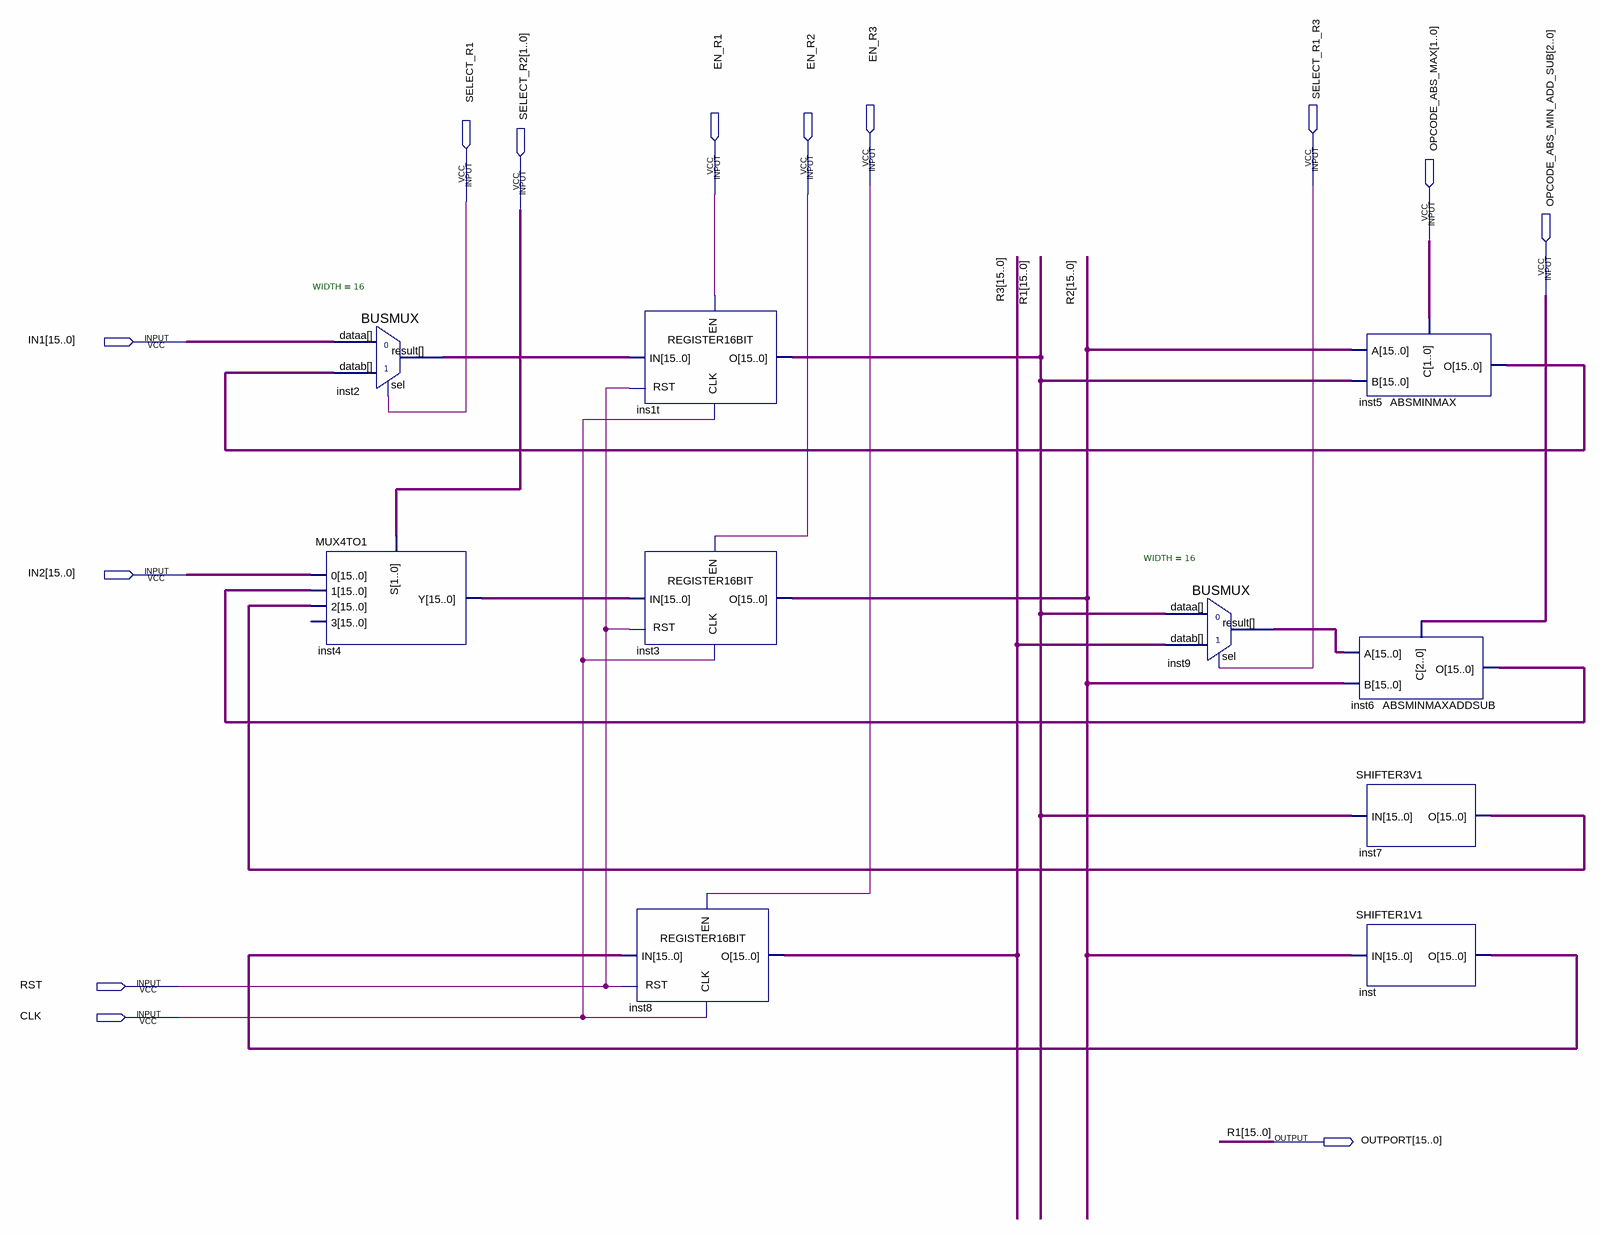
[diagram p0: schematic sheet]
// Quartus schematic DATAPATH_SF.bdf as structural Verilog: 10 symbols, 13 pins
module DATAPATH_SF (
  input  EN_R3,
  input  SELECT_R1_R3,
  input  EN_R1,
  input  EN_R2,
  input  SELECT_R1,
  input  [1:0] SELECT_R2,
  input  [1:0] OPCODE_ABS_MAX,
  input  [2:0] OPCODE_ABS_MIN_ADD_SUB,
  input  [15:0] IN1,
  input  [15:0] IN2,
  input  RST,
  input  CLK,
  output [15:0] OUTPORT
);

  wire [15:0] inst2_result, inst4_y, inst5_o, inst6_o, inst7_o, inst9_result, inst_o, R2, R3;

  BUSMUX #(.WIDTH(16)) inst2 (.datab(inst5_o), .sel(SELECT_R1), .dataa(IN1), .result(inst2_result));
  MUX4TO1 inst4 (.\0 (IN2), .\1 (inst6_o), .\2 (inst7_o), .S(SELECT_R2), .Y(inst4_y));  // open: 3
  REGISTER16BIT ins1t (.IN(inst2_result), .EN(EN_R1), .CLK(CLK), .RST(RST), .O(OUTPORT));
  REGISTER16BIT inst3 (.IN(inst4_y), .EN(EN_R2), .CLK(CLK), .RST(RST), .O(R2));
  REGISTER16BIT inst8 (.IN(inst_o), .EN(EN_R3), .CLK(CLK), .RST(RST), .O(R3));
  BUSMUX #(.WIDTH(16)) inst9 (.datab(R3), .sel(SELECT_R1_R3), .dataa(OUTPORT), .result(inst9_result));
  ABSMINMAX inst5 (.C(OPCODE_ABS_MAX), .A(R2), .B(OUTPORT), .O(inst5_o));
  ABSMINMAXADDSUB inst6 (.C(OPCODE_ABS_MIN_ADD_SUB), .A(inst9_result), .B(R2), .O(inst6_o));
  SHIFTER3V1 inst7 (.IN(OUTPORT), .O(inst7_o));
  SHIFTER1V1 inst (.IN(R2), .O(inst_o));

  // Other names for the same wires on the sheet: R1[15:0] = OUTPORT
endmodule
